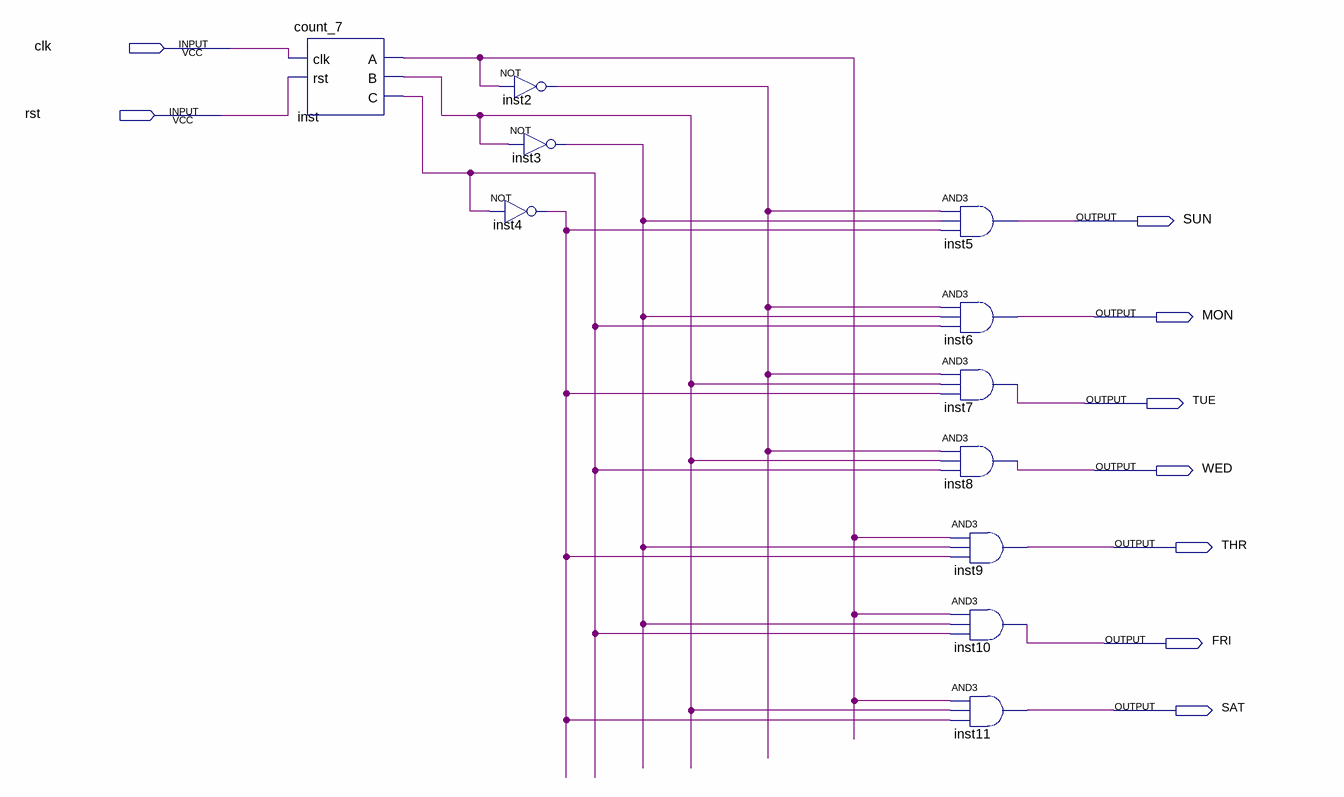
[diagram p0: schematic sheet]
// Quartus schematic week.bdf as structural Verilog: 11 symbols, 9 pins
module week (
  input  clk,
  input  rst,
  output SUN,
  output MON,
  output TUE,
  output WED,
  output THR,
  output FRI,
  output SAT
);

  wire inst2_out, inst3_out, inst4_out, inst_a, inst_b, inst_c;

  count_7 inst (.clk(clk), .rst(rst), .A(inst_a), .B(inst_b), .C(inst_c));
  not inst2 (inst2_out, inst_a);
  not inst3 (inst3_out, inst_b);
  not inst4 (inst4_out, inst_c);
  and inst5 (SUN, inst2_out, inst3_out, inst4_out);
  and inst6 (MON, inst2_out, inst3_out, inst_c);
  and inst7 (TUE, inst2_out, inst_b, inst4_out);
  and inst8 (WED, inst2_out, inst_b, inst_c);
  and inst9 (THR, inst_a, inst3_out, inst4_out);
  and inst10 (FRI, inst_a, inst3_out, inst_c);
  and inst11 (SAT, inst_a, inst_b, inst4_out);
endmodule
